# EAGLE design TrackerBase2 (EAGLE 9.6.2)
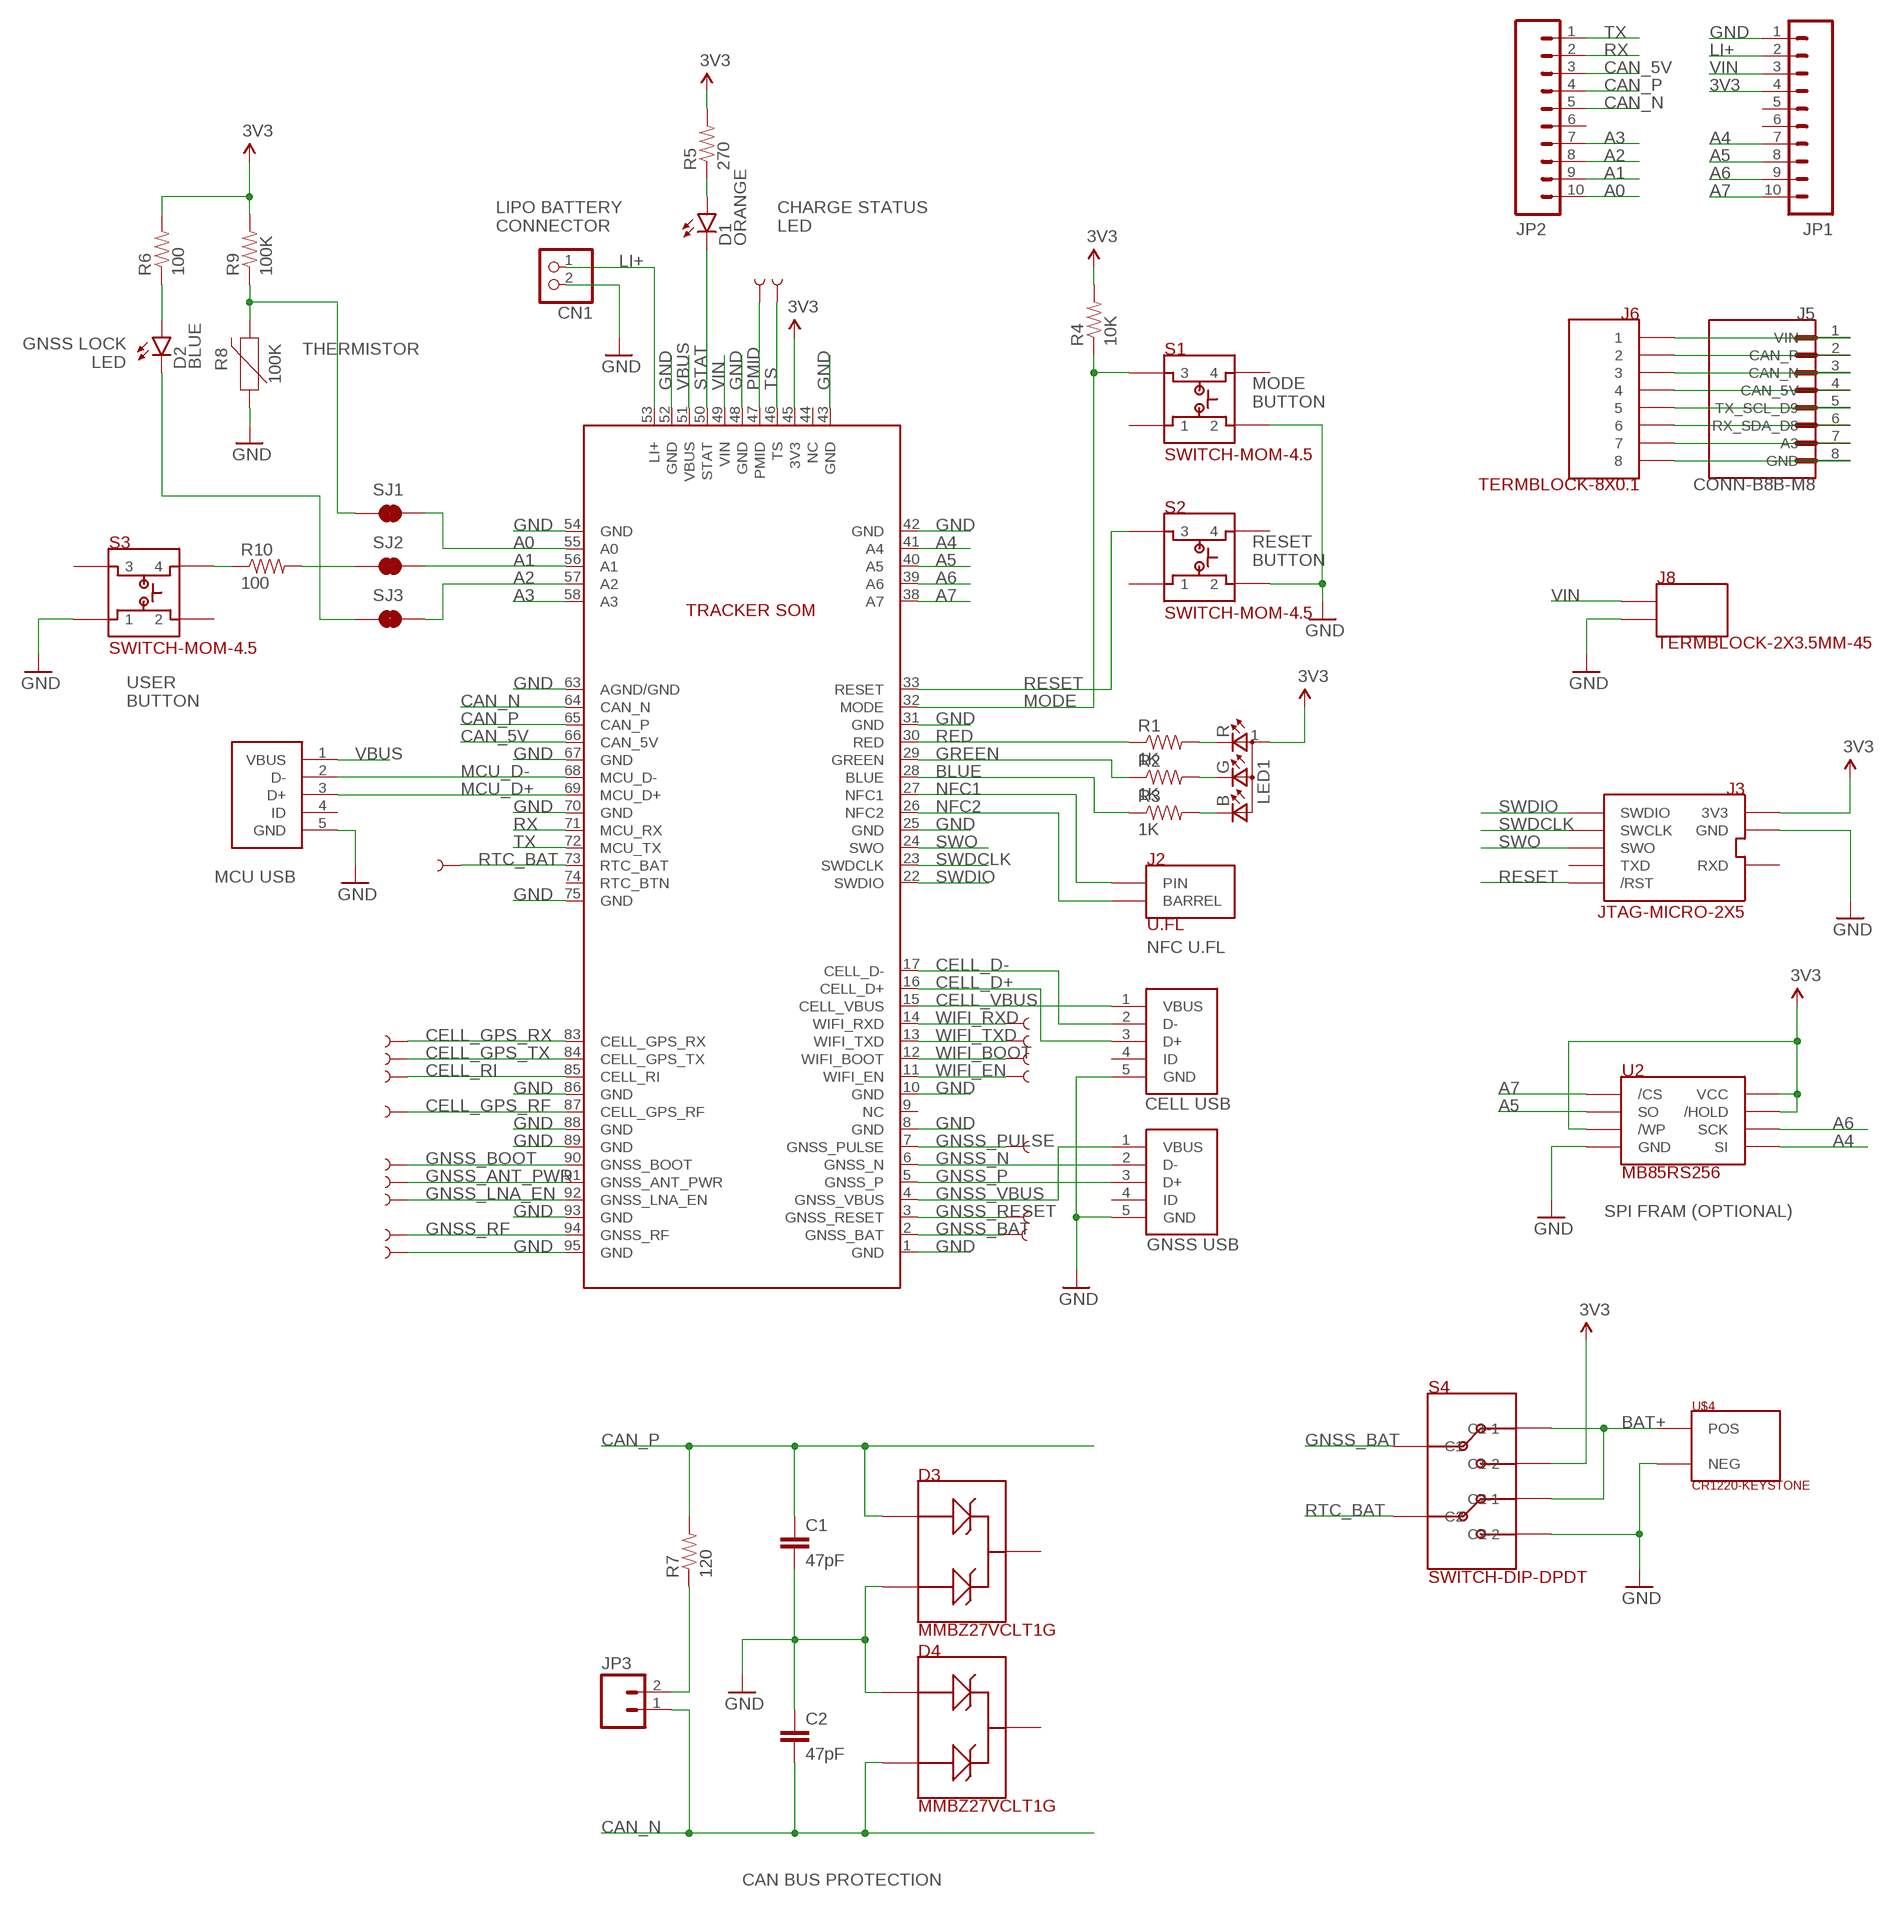
[diagram p0: schematic, sheet 1]

## Parts
C1  47pF  CAP-47PF-0603  [0603-CAP]
C2  47pF  CAP-47PF-0603  [0603-CAP]
CN1  JST_2PIN-THM  [JST-PH-2-THM]
D1  ORANGE  LED-ORANGE0603  [LED-0603]
D2  BLUE  LED-BLUE0603  [LED-0603]
D3  MMBZ27VCLT1G  TVS-MMBZ27VCLT1G  [SOT-23-3-ON]
D4  MMBZ27VCLT1G  TVS-MMBZ27VCLT1G  [SOT-23-3-ON]
J1  USB-MICRO-B-VERT-PTH  [USB-MICRO-B-VERT-PTH]
J2  U.FL  CONN-UFL-TE  [CONN-UFL-TE]
J3  JTAG-MICRO-2X5  [JTAG-MICRO-2X5]
J4  USB-MICRO-B-VERT-PTH  [USB-MICRO-B-VERT-PTH]
J5  CONN-B8B-M8  [JST_B8B-PH-SM4-TB(LF)(SN)]
J6  TERMBLOCK-8X0.1  [TERMBLOCK-8X0.1]
J7  USB-MICRO-B-VERT-PTH  [USB-MICRO-B-VERT-PTH]
J8  TERMBLOCK-2X3.5MM-45  [TERMBLOCK-2X3.5MM-45]
JP1  M10  [1X10]
JP2  M10  [1X10]
JP3  M02PTH  [1X02]
LED1  RGB  LED-RGB-CREE-SMD  [LED-RGB-CREE-SMD]
R1  1K  RES-1K-0603  [0603-RES]
R2  1K  RES-1K-0603  [0603-RES]
R3  1K  RES-1K-0603  [0603-RES]
R4  10K  RES-10K-06030603  [0603-RES]
R5  270  RES-270-0603.DEV  [0603-RES]
R6  100  RES-100-0603.DEV  [0603-RES]
R7  120  RES-120-0603  [0603-RES]
R8  100K  NTC-THERMISTOR-0603  [0603]
R9  100K  RES-100K-0603  [0603-RES]
R10  100  RES-100-0603.DEV  [0603-RES]
S1  SWITCH-MOM-4.5  [SWITCH-MOM-4.5]
S2  SWITCH-MOM-4.5  [SWITCH-MOM-4.5]
S3  SWITCH-MOM-4.5  [SWITCH-MOM-4.5]
S4  SWITCH-DIP-DPDT  [SWITCH-DIP-DPDT]
SJ1  JUMPER-PAD-2-NC_BY_TRACENO_SILK  [PAD-JUMPER-2-NC_BY_TRACE_NO_SILK]
SJ2  JUMPER-PAD-2-NC_BY_TRACENO_SILK  [PAD-JUMPER-2-NC_BY_TRACE_NO_SILK]
SJ3  JUMPER-PAD-2-NC_BY_TRACENO_SILK  [PAD-JUMPER-2-NC_BY_TRACE_NO_SILK]
TP1  TEST-POINTTP_15TH_THRU  [TP_15TH]
TP2  TEST-POINTTP_15TH_THRU  [TP_15TH]
TP3  TEST-POINTTP_15TH_THRU  [TP_15TH]
TP4  TEST-POINTTP_15TH_THRU  [TP_15TH]
TP5  TEST-POINTTP_15TH_THRU  [TP_15TH]
TP6  TEST-POINTTP_15TH_THRU  [TP_15TH]
TP7  TEST-POINTTP_15TH_THRU  [TP_15TH]
TP8  TEST-POINTTP_15TH_THRU  [TP_15TH]
TP9  TEST-POINTTP_15TH_THRU  [TP_15TH]
TP10  TEST-POINTTP_15TH_THRU  [TP_15TH]
TP11  TEST-POINTTP_15TH_THRU  [TP_15TH]
TP12  TEST-POINTTP_15TH_THRU  [TP_15TH]
TP13  TEST-POINTTP_15TH_THRU  [TP_15TH]
TP14  TEST-POINTTP_15TH_THRU  [TP_15TH]
TP15  TEST-POINTTP_15TH_THRU  [TP_15TH]
TP16  TEST-POINTTP_15TH_THRU  [TP_15TH]
TP17  TEST-POINTTP_15TH_THRU  [TP_15TH]
TP18  TEST-POINTTP_15TH_THRU  [TP_15TH]
TP19  TEST-POINTTP_15TH_THRU  [TP_15TH]
U1  TRACKER-SOM-SKIP-NC  [TRACKER-SOM-SKIP-NC]
U2  MB85RS256  MB85RS256-FRAM  [8-SOIC-MAXIM]
U$4  CR1220-KEYSTONE  [CR1220-KEYSTONE]

## Nets
3V3: J3.1(3V3) JP1.4 LED1.1(A) R4.2 R5.2 R6.2 R9.2 S4.C1-2 U1.45(3V3) U2.3(/WP) U2.7(/HOLD) U2.8(VCC)
A0: JP2.10 SJ1.2 U1.55(A0)
A1: JP2.9 SJ2.2 U1.56(A1)
A2: JP2.8 SJ3.2 U1.57(A2)
A3: J5.7(A3) J6.P$7 JP2.7 U1.58(A3)
A4: JP1.7 U1.41(A4) U2.5(SI)
A5: JP1.8 U1.40(A5) U2.2(SO)
A6: JP1.9 U1.39(A6) U2.6(SCK)
A7: JP1.10 U1.38(A7) U2.1(/CS)
BAT+: S4.C1-1 S4.C2-1 U$4.POS
BLUE: R3.1 U1.28(BLUE)
CAN_5V: J5.4(CAN_5V) J6.P$4 JP2.3 U1.66(CAN_5V)
CAN_N: C2.2 D4.2 J5.3(CAN_N) J6.P$3 JP2.5 JP3.1 U1.64(CAN_N)
CAN_P: C1.1 D3.1 J5.2(CAN_P) J6.P$2 JP2.4 R7.2 U1.65(CAN_P)
CELL_D+: J1.3(D+) U1.16(CELL_D+)
CELL_D-: J1.2(D-) U1.17(CELL_D-)
CELL_GPS_RF: TP14.P$1 U1.87(CELL_GPS_RF)
CELL_GPS_RX: TP7.P$1 U1.83(CELL_GPS_RX)
CELL_GPS_TX: TP8.P$1 U1.84(CELL_GPS_TX)
CELL_RI: TP9.P$1 U1.85(CELL_RI)
CELL_VBUS: J1.1(VBUS) U1.15(CELL_VBUS)
GND: C1.2 C2.1 CN1.2 D3.2 D4.1 J1.5(GND) J3.3(GND) J3.5(GND) J3.9(GND) J4.5(GND) J5.8(GND) J6.P$8 J7.5(GND) J8.2 JP1.1 R8.1 S1.2 S2.2 S3.1 S4.C2-2 TP19.P$1 U1.1(GND) U1.8(GND) U1.10(GND) U1.25(GND) U1.31(GND) U1.42(GND) U1.43(GND) U1.48(GND) U1.52(GND) U1.54(GND) U1.63(AGND/GND) U1.67(GND) U1.70(GND) U1.75(GND) U1.86(GND) U1.88(GND) U1.89(GND) U1.93(GND) U1.95(GND) U2.4(GND) U$4.NEG
GNSS_ANT_PWR: TP11.P$1 U1.91(GNSS_ANT_PWR)
GNSS_BAT: S4.C1 TP17.P$1 U1.2(GNSS_BAT)
GNSS_BOOT: TP10.P$1 U1.90(GNSS_BOOT)
GNSS_LNA_EN: TP12.P$1 U1.92(GNSS_LNA_EN)
GNSS_N: J4.2(D-) U1.6(GNSS_N)
GNSS_P: J4.3(D+) U1.5(GNSS_P)
GNSS_PULSE: TP5.P$1 U1.7(GNSS_PULSE)
GNSS_RESET: TP6.P$1 U1.3(GNSS_RESET)
GNSS_RF: TP13.P$1 U1.94(GNSS_RF)
GNSS_VBUS: J4.1(VBUS) U1.4(GNSS_VBUS)
GREEN: R2.1 U1.29(GREEN)
LI+: CN1.1 JP1.2 U1.53(LI+)
MCU_D+: J7.3(D+) U1.69(MCU_D+)
MCU_D-: J7.2(D-) U1.68(MCU_D-)
MODE: R4.1 S1.3 U1.32(MODE)
N$2: JP3.2 R7.1
N$3: LED1.2(B) R3.2
N$4: LED1.3(G) R2.2
N$5: LED1.4(R) R1.2
N$14: D1.A R5.1
N$16: R8.2 R9.1 SJ1.1
N$17: D2.A R6.1
N$18: R10.1 S3.4
N$19: R10.2 SJ2.1
N$20: D2.C SJ3.1
NFC1: J2.PIN U1.27(NFC1)
NFC2: J2.BL(BARREL) J2.BR(BARREL) U1.26(NFC2)
PMID: TP15.P$1 U1.47(PMID)
RED: R1.1 U1.30(RED)
RESET: J3.10(/RST) S2.3 U1.33(RESET)
RTC_BAT: S4.C2 TP18.P$1 U1.73(RTC_BAT)
RX: J5.6(RX_SDA_D8) J6.P$6 JP2.2 U1.71(MCU_RX)
STAT: D1.C U1.50(STAT)
SWDCLK: J3.4(SWCLK) U1.23(SWDCLK)
SWDIO: J3.2(SWDIO) U1.22(SWDIO)
SWO: J3.6(SWO) U1.24(SWO)
TS: TP16.P$1 U1.46(TS)
TX: J5.5(TX_SCL_D9) J6.P$5 JP2.1 U1.72(MCU_TX)
VBUS: J7.1(VBUS) U1.51(VBUS)
VIN: J5.1(VIN) J6.P$1 J8.1 JP1.3 U1.49(VIN)
WIFI_BOOT: TP3.P$1 U1.12(WIFI_BOOT)
WIFI_EN: TP4.P$1 U1.11(WIFI_EN)
WIFI_RXD: TP1.P$1 U1.14(WIFI_RXD)
WIFI_TXD: TP2.P$1 U1.13(WIFI_TXD)
Unconnected: D3.3 D4.3 J1.4(ID) J3.7(RXD) J3.8(TXD) J4.4(ID) J7.4(ID) JP1.5 JP1.6 JP2.6 S1.1 S1.4 S2.1 S2.4 S3.2 S3.3 U1.9(NC) U1.44(NC) U1.74(RTC_BTN)

## Notes on the sheet
- LIPO BATTERY
  CONNECTOR
- CHARGE STATUS
  LED
- GNSS LOCK
  LED
- THERMISTOR
- MODE
  BUTTON
- RESET
  BUTTON
- USER
  BUTTON
- MCU USB
- NFC U.FL
- CELL USB
- SPI FRAM (OPTIONAL)
- GNSS USB
- CAN BUS PROTECTION

## Library data of the parts
C1 C2 = rickk2:CAP-47PF-0603: CAP CER 47PF 100V C0G/NP0 0603 Murata Electronics GCM1885C2A470FA16D $0.22 47pF ±1% 100V Ceramic Capacitor C0G, NP0 0603 (1608 Metric) https://www.digikey.com/product-detail/en/murata-electronics/GCM1885C2A470FA16D/490-16408-1-ND/7363390 - Ordered 10 2020-08-27
CN1 = rickk2:JST_2PIN: JST 2-Pin Connectors of various flavors SMT-RA (S2B-PH-SM4) 4UConnector #17311 SMT (B2B-PH-SM4) THM-RA (S2B-PH) THM (B2B-PH) 1=+ 2=- THM: CONN HEADER PH TOP 2POS 2MM $0.17 B2B-PH-K-S(LF)(SN) https://www.digikey.com/product-detail/en/jst-sales-america-inc/B2B-PH-K-S-LF-SN/455-1704-ND/926611 RA Version: https://www.digikey.com/products/en?keywords=455-1719-ND
D1 = rickk2:LED-ORANGE: Lite-On LTST-C193KFKT-5A LED ORANGE CLEAR 0603 SMD $ 0.41 Orange 605nm LED Indication - Discrete 2V 0603 (1608 Metric) https://www.digikey.com/product-detail/en/lite-on-inc/LTST-C193KFKT-5A/160-1829-1-ND/2356249 R = 270 ohms @ 3.3V Stripe is on the anode (+) side on the bottom side!
D2 = rickk2:LED-BLUE: Lite-On LTST-C193TBKT-5A 0603 clear lens 6.25 mcd 130° viewing 15 mcd 5mA @ 2.8V $0.47 Blue 470nm LED Indication - Discrete 2.8V 0603 (1608 Metric) https://www.digikey.com/product-detail/en/lite-on-inc/LTST-C193TBKT-5A/160-1827-1-ND/2355044 R = 100 ohms @ 3.3V Stripe is on the anode (+) side on the bottom side!
D3 D4 = rickk2:TVS-MMBZ27VCLT1G: TVS DIODE 22V 38V SOT23-3 ON Semiconductor MMBZ27VCLT1G $0.20 38V Clamp 1A Ipp Tvs Diode Surface Mount SOT-23-3 (TO-236) https://www.digikey.com/product-detail/en/on-semiconductor/MMBZ27VCLT1G/MMBZ27VCLT1GOSCT-ND/964555
J1 J4 J7 = rickk2:USB-MICRO-B-VERT-PTH: MICRO B SKT, VERTICAL, TH GCT USB3131-30-0230-A $0.84 USB - micro B USB 2.0 Receptacle Connector 5 Position Through Hole https://www.digikey.com/product-detail/en/gct/USB3131-30-0230-A/2073-USB3131-30-0230-ACT-ND/9859713
J2 = rickk2:CONN-UFL-TE: U.FL TE Connectivity AMP Connectors 1909763-1 $0.50 CONN UMCC JACK STR 50OHM SMD U.FL (UMCC) Connector Jack, Male Pin 50Ohm Surface Mount Solder https://www.digikey.com/product-detail/en/te-connectivity-amp-connectors/1909763-1/A118077CT-ND/4729711
J3 = rickk2:JTAG-MICRO-2X5: JTAG Connector $2.90 CONN HEADER SMD 10POS 1.27MM Connector Header Surface Mount 10 position 0.050" (1.27mm) Samtec FTSH-105-01-F-DV-K https://www.digikey.com/product-detail/en/FTSH-105-01-F-DV-K/SAM8796-ND/2649974?utm_campaign=buynow&WT.z_cid=ref_octopart_dkc_buynow&utm_medium=aggregator&curr=usd&site=us&utm_source=octopart
J5 = rickk2:CONN-B8B-M8: PH Series 2 mm Pitch 12 Position SMT Single Row Top Entry Shrouded Header
J6 = rickk2:TERMBLOCK-8X0.1: Term Block 8x0.1" 20-30AWG 6A 125V Max Side Entry On Shore Technology Inc. OSTVN08A150 TERM BLK 8P SIDE ENT 2.54MM PCB 8 Position Wire to Board Terminal Block Horizontal with Board 0.100" (2.54mm) Through Hole https://www.digikey.com/product-detail/en/on-shore-technology-inc/OSTVN08A150/ED10566-ND/1588868
J8 = rickk2:TERMBLOCK-2X3.5MM-45: TERM BLOCK 2POS 45DEG 3.5MM PCB Phoenix Contact 1988956 $0.48 2 Position Wire to Board Terminal Block 45° (135°) Angle with Board 0.138" (3.50mm) Through Hole https://www.digikey.com/product-detail/en/phoenix-contact/1988956/277-1779-ND/950907
JP1 JP2 = rickk2:M10: Sullins Connector Solutions PPTC101LFBN-RC $0.65 10 Position Header Connector Through Hole https://www.digikey.com/product-detail/en/sullins-connector-solutions/PPTC101LFBN-RC/S7008-ND/810149
JP3 = rickk2:M02: Standard 2-pin 0.1" header. Use with - straight break away headers ( PRT-00116) - right angle break away headers (PRT-00553) - swiss pins (PRT-00743) - machine pins (PRT-00117) - female headers (PRT-00115) Molex polarized connector foot print use with: PRT-08233 with associated crimp pins and housings. 2.54_SCREWTERM for use with PRT-10571. 3.5mm Screw Terminal footprints for PRT-08084 5mm Screw Terminal footprints for use with PRT-08432
LED1 = rickk2:LED-RGB-CREE-SMD: https://www.digikey.com/product-detail/en/cree-inc/CLMVC-FKA-CL1D1L71BB7C3C3/CLMVC-FKA-CL1D1L71BB7C3C3CT-ND/9094273 CLMVC-FKA-CL1D1L71BB7C3C3 LED RGB CLEAR 4PLCC SMD Red, Green, Blue (RGB) 622nm Red, 530nm Green, 470nm Blue LED Indication - Discrete 2V Red, 3V Green, 3V Blue 4-SMD, J-Lead $0.19 Millicandela Rating 337mcd Red, 420mcd Green, 84mcd Blue Voltage - Forward (Vf) (Typ) 2V Red, 3V Green, 3V Blue Current - Test 20mA Red, 10mA Green, 10mA Blue Wavelength - Dominant 622nm Red, 530nm Green, 470nm Blue 2.00mm L x 2.00mm W x 1.00mm H Old One: LED RGB DIFFUSED 4SMD $ 0.35 Cree CLMVB-FKA-CFHEHLCBB7A363 2mm 4-PLCC common anode RGB LED https://www.digikey.com/product-detail/en/cree-inc/CLMVB-FKA-CFHEHLCBB7A363/CLMVB-FKA-CFHEHLCBB7A363CT-ND/6138627 Red=68 ohm, Green/Blue=33 ohm @ 3.3V
R1-R3 = rickk2:RES-1K-0603: RES SMD 1K OHM 0.5% 1/5W 0603 $ 0.17 https://www.digikey.com/product-detail/en/panasonic-electronic-components/ERJ-PB3D1001V/P20283CT-ND/6214538 Panasonic
R4 = rickk2:RES-10K-0603: RES SMD 10K OHM 5% 1/4W 0603 $ 0.10 https://www.digikey.com/product-detail/en/panasonic-electronic-components/ERJ-PA3J103V/P10KBZCT-ND/5036237
R5 = rickk2:RES-270-0603.DEV: RES SMD 270 OHM 5% 1/10W 0603 $0.10 Panasonic ERJ-3GEYJ271V ±5% 0.1W, 1/10W Chip Resistor 0603 (1608 Metric) Automotive AEC-Q200 Thick Film https://www.digikey.com/product-detail/en/panasonic-electronic-components/ERJ-3GEYJ271V/P270GCT-ND/134766
R6 R10 = rickk2:RES-100-0603.DEV: RES SMD 100 OHM 5% 1/10W 0603 $ 0.10 ±5% 0.1W, 1/10W Chip Resistor 0603 (1608 Metric) Automotive AEC-Q200 Thick Film https://www.digikey.com/product-detail/en/panasonic-electronic-components/ERJ-3GEYJ101V/P100GCT-ND/134714
R7 = rickk2:RES-120-0603: Not ordered yet! Panasonic Electronic Components ERJ-3EKF1200V RES SMD 120 OHM 1% 1/10W 0603 120 Ohms ±1% 0.1W, 1/10W Chip Resistor 0603 (1608 Metric) Automotive AEC-Q200 Thick Film https://www.digikey.com/product-detail/en/panasonic-electronic-components/ERJ-3EKF1200V/P120HCT-ND/1746726
R8 = rickk2:NTC-THERMISTOR: NTC Thermistor An NTC thermistor's resistance decreases as temperature rises. Applications: Resistance Thermometer - temperature monitoring Inrush current limiter Heat source; PROD_ID: RES-13608; VALUE: 10k
R9 = rickk2:RES-100K-0603: 100 kOhms ±1% 0.1W, 1/10W Chip Resistor 0603 (1608 Metric) Automotive AEC-Q200 Thick Film https://www.digikey.com/product-detail/en/panasonic-electronic-components/ERJ-3EKF1003V/P100KHCT-ND/198110 Old: RES SMD 100K OHM 1% 1/4W 0603 $ 0.16 Panasonic ERJ-PA3F1003V ±1% 0.25W, 1/4W Chip Resistor 0603 (1608 Metric) Automotive AEC-Q200, Pulse Withstanding Thick Film https://www.digikey.com/product-detail/en/panasonic-electronic-components/ERJ-PA3F1003V/P100KBYCT-ND/5036116
S1-S3 = rickk2:SWITCH-MOM-4.5: Manufacturer: E-Switch Manufacturer Part Number: TL3305AF160QG Description: SWITCH TACTILE SPST-NO 50MA 12V Detailed Description: Tactile Switch SPST-NO Top Actuated Surface Mount $0.20 https://www.digikey.com/product-detail/en/e-switch/TL3305AF160QG/EG5350CT-ND/5816195
S4 = rickk2:SWITCH-DIP-DPDT: SWITCH ROCKER DIP DPDT 150MA 30V Grayhill Inc. 76SD01T $3.84 Dip Switch DPDT 1 Position Through Hole Rocker Actuator 150mA 30VDC https://www.digikey.com/product-detail/en/grayhill-inc/76SD01T/GH7719-ND/2680736
SJ1-SJ3 = rickk2:JUMPER-PAD-2-NC_BY_TRACE
TP1-TP19 = rickk2:TEST-POINT: SparkFun Test Points Bare copper test points for troubleshooting or In-Circuit-Testing. These are used by our Production team for verifying production board runs using pogo-pins on test beds. SparkFun Products: SparkFun LSM9DS1 Breakout <https://www.sparkfun.com/products/13284> SparkFun PSOC <https://www.sparkfun.com/products/13714> SparkFun Load Cell Amplifier <https://www.sparkfun.com/products/13879>
U1 = rickk2:TRACKER-SOM-SKIP-NC: Tracker SoM
U2 = rickk2:MB85RS256-FRAM: IC FRAM 256K SPI 33MHZ 8SOP Fujitsu Electronics America, Inc. MB85RS256BPNF-G-JNERE1 $3.75 FRAM (Ferroelectric RAM) Memory IC 256Kb (32K x 8) SPI 33MHz 8-SOP https://www.digikey.com/product-detail/en/fujitsu-electronics-america-inc/MB85RS256BPNF-G-JNERE1/865-1251-1-ND/4022686; VALUE: MB85RC64
U$4 = rickk2:CR1220-KEYSTONE: Keystone Electronics 1056TR $ 1.09 BATTERY HOLDER COIN 12.5MM SMD https://www.digikey.com/product-detail/en/keystone-electronics/1056/36-1056-ND/2020198

## Board
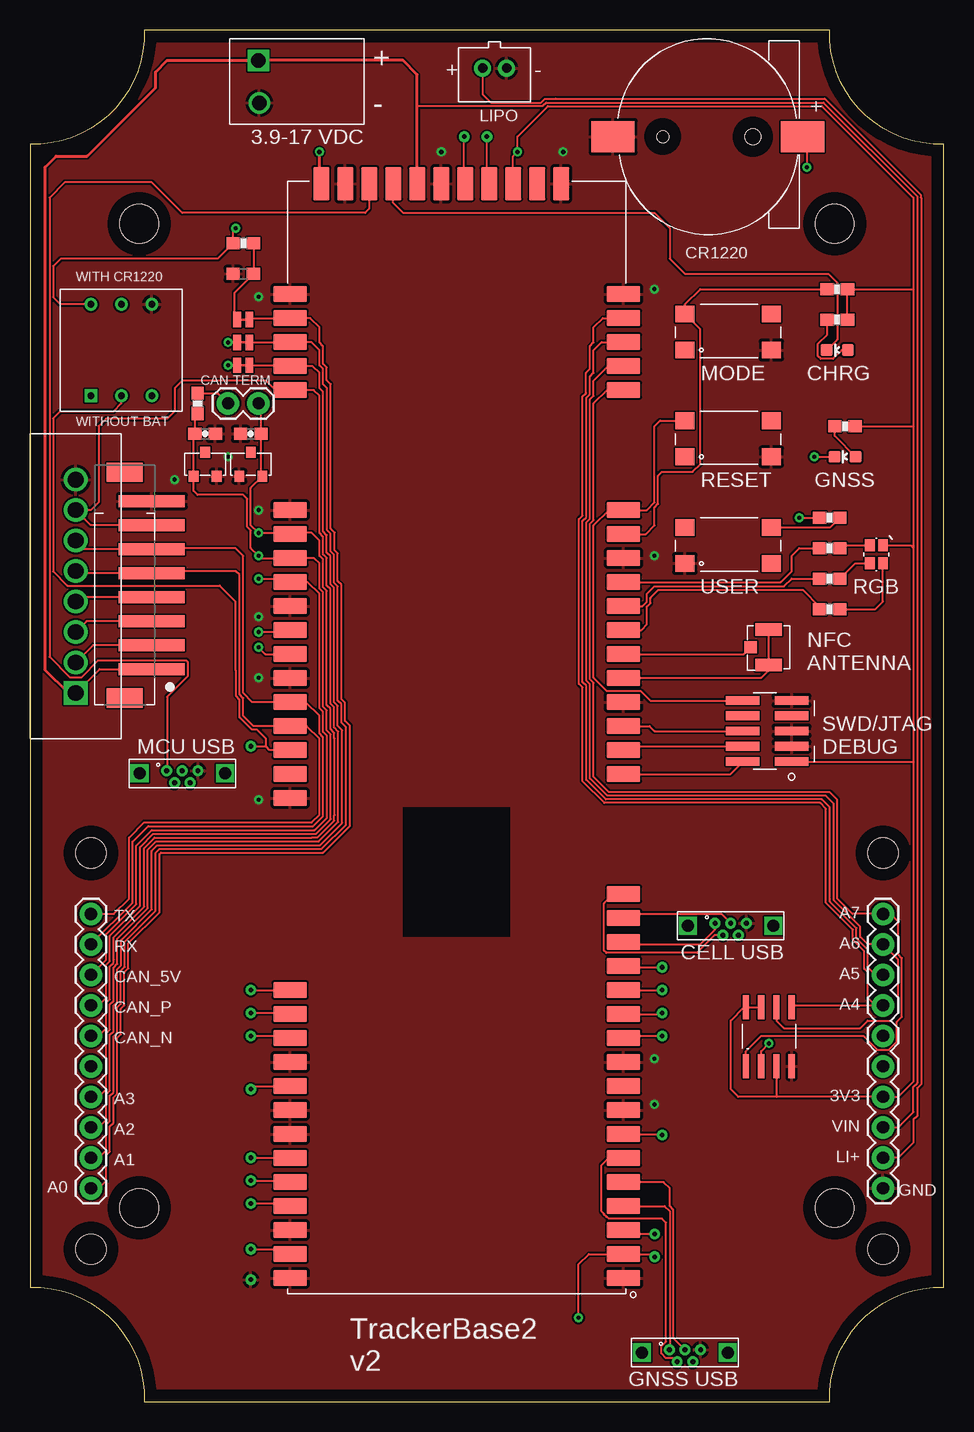
[diagram p1: board, top side]
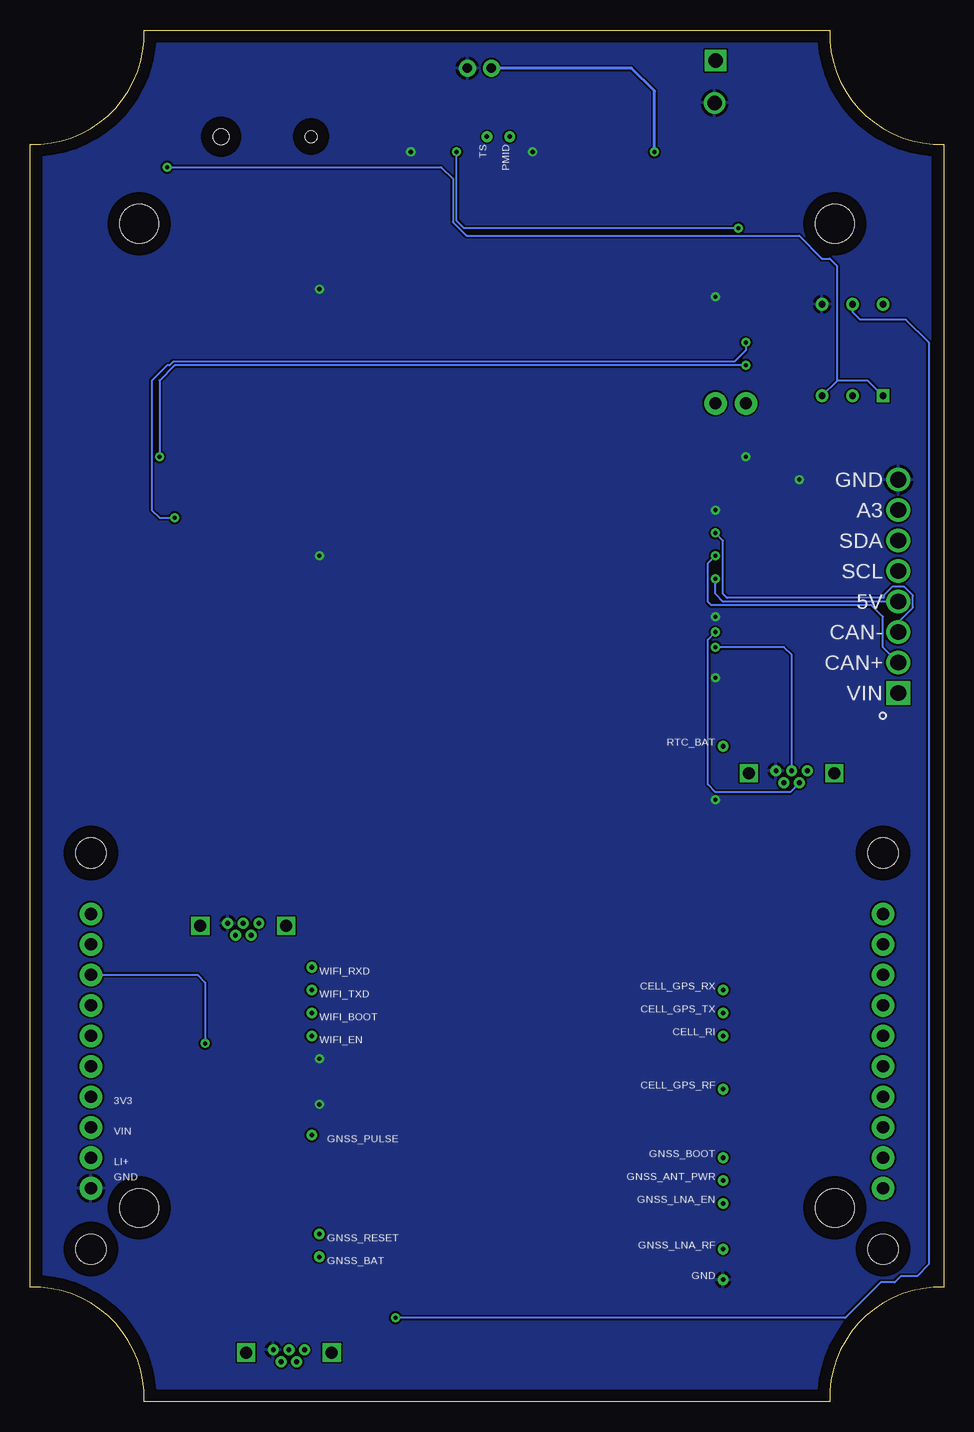
[diagram p2: board, bottom side, seen from below]

Size 76.2 x 114.3 mm. Coordinates in mm from the lower left corner, seen from the top.
Outline: 9.53,0 66.67,0 arc-94 76.2,9.53 76.2,104.78 arc-94 66.67,114.3 9.53,114.3 arc-94 0,104.78 0,9.53 arc-94 9.53,0
Copper layers (1*16): Top 0.035mm / dielectric 1.5mm / Bottom 0.035mm
Design rules "default": minimum track width 6mil, minimum drill 0.35mm, track to track 6mil, track to pad 6mil, pad to pad 6mil, via to via 6mil, smd to smd 6mil, copper to edge 40mil, drill to drill 6mil, minimum pad ring 10mil, minimum via ring 8mil, stop-mask expansion 4mil, vias tented up to drill 0mil, thermal gap 10mil
Holes 3.2 mm at 67.1,98.15 9.1,98.15 9.1,16.15 67.1,16.15
Holes 2.51 mm at 5.08,12.7 71.12,12.7 71.12,45.72 5.08,45.72
bKeepout: area 6.6,74.7 to 11.6,79.7; area 6.6,34.6 to 11.6,39.6; area 64.6,34.6 to 69.6,39.6; area 64.6,74.7 to 69.6,79.7; area 35.6,102.7 to 40.6,107.7; area 35.6,6.7 to 40.6,11.7

### Footprints (pad centres in the part's own frame; a part is rotated, then mirrored left to right if it is on the bottom)
0603-CAP = smd 1.1 x 1: 1 -0.85,0; 2 0.85,0
JST-PH-2-THM = drill 0.8 pad 1.422: 1 1,0; 2 -1,0
LED-0603 = smd 1 x 1: A 0,-0.877; C 0,0.877
SOT-23-3-ON = smd 0.8 x 0.9: 1 -0.96,-1; 2 0.96,-1; 3 0,1
USB-MICRO-B-VERT-PTH = drill 0.4: 1 -1.3,0.5; 2 -0.65,-0.5; 3 0,0.5; 4 0.65,-0.5; 5 1.3,0.5 | drill 1 square: P$1 -3.575,0.28; P$2 3.575,0.28
CONN-UFL-TE = smd 1.05 x 2.2: BL -1.475,0; BR 1.475,0 | smd 1 x 1.05: PIN 0,-1.525
JTAG-MICRO-2X5 = smd 0.737 x 2.794: 1 0,0; 2 0,4.064; 3 1.27,0; 4 1.27,4.064; 5 2.54,0; 6 2.54,4.064; 7 3.81,0; 8 3.81,4.064; 9 5.08,0; 10 5.08,4.064
JST_B8B-PH-SM4-TB(LF)(SN) = smd 1 x 5.5: 1 -5,0; 2 -3,0; 3 -1,0; 4 1,0; 5 3,0; 6 5,0; 7 7,0; 8 9,0 | smd 1.6 x 3: P1 -7.4,2.25; P2 11.4,2.25
TERMBLOCK-8X0.1 = drill 1.321 square: P$1 -8.89,0 | drill 1.321: P$2 -6.35,0; P$3 -3.81,0; P$4 -1.27,0; P$5 1.27,0; P$6 3.81,0; P$7 6.35,0; P$8 8.89,0
TERMBLOCK-2X3.5MM-45 = drill 1.2 square: 1 0,0 | drill 1.2: 2 3.54,0.07
1X10 = drill 1.016 pad 1.88: 1 0,0; 2 2.54,0; 3 5.08,0; 4 7.62,0; 5 10.16,0; 6 12.7,0; 7 15.24,0; 8 17.78,0; 9 20.32,0; 10 22.86,0
1X02 = drill 1.016 pad 1.88: 1 0,0; 2 2.54,0
LED-RGB-CREE-SMD = smd 1 x 0.8: 1 1.5,0; 2 0,0; 3 0,1.1; 4 1.5,1.1
0603-RES = smd 1.1 x 1: 1 -0.85,0; 2 0.85,0
0603 = smd 1.1 x 1: 1 -0.85,0; 2 0.85,0
SWITCH-MOM-4.5 = smd 1.6 x 1.4: 1 0,0; 2 7.2,0; 3 0,3; 4 7.2,3
SWITCH-DIP-DPDT = drill 0.559: C1 0,5.08; C1-2 -2.54,5.08; C2 0,-2.54; C2-1 2.54,-2.54; C2-2 2.54,5.08 | drill 0.559 square: C1-1 -2.54,-2.54
PAD-JUMPER-2-NC_BY_TRACE_NO_SILK = smd 0.635 x 1.27: 1 -0.508,0; 2 0.508,0
TP_15TH = drill 0.381 pad 0.61: P$1 0,0
TRACKER-SOM-SKIP-NC = smd 2.8 x 1.35: 1 27.9,-91.3; 2 27.9,-89.3; 3 27.9,-87.3; 4 27.9,-85.3; 5 27.9,-83.3; 6 27.9,-81.3; 7 27.9,-79.3; 8 27.9,-77.3; 9 27.9,-75.3; 10 27.9,-73.3; 11 27.9,-71.3; 12 27.9,-69.3; 13 27.9,-67.3; 14 27.9,-65.3; 15 27.9,-63.3; 16 27.9,-61.3; 17 27.9,-59.3; 22 27.9,-49.3; 23 27.9,-47.3; 24 27.9,-45.3; 25 27.9,-43.3; 26 27.9,-41.3; 27 27.9,-39.3; 28 27.9,-37.3; 29 27.9,-35.3; 30 27.9,-33.3; 31 27.9,-31.3; 32 27.9,-29.3; 33 27.9,-27.3; 38 27.9,-17.3; 39 27.9,-15.3; 40 27.9,-13.3; 41 27.9,-11.3; 42 27.9,-9.3; 54 0.1,-9.3; 55 0.1,-11.3; 56 0.1,-13.3; 57 0.1,-15.3; 58 0.1,-17.3; 63 0.1,-27.3; 64 0.1,-29.3; 65 0.1,-31.3; 66 0.1,-33.3; 67 0.1,-35.3; 68 0.1,-37.3; 69 0.1,-39.3; 70 0.1,-41.3; 71 0.1,-43.3; 72 0.1,-45.3; 73 0.1,-47.3; 74 0.1,-49.3; 75 0.1,-51.3; 83 0.1,-67.3; 84 0.1,-69.3; 85 0.1,-71.3; 86 0.1,-73.3; 87 0.1,-75.3; 88 0.1,-77.3; 89 0.1,-79.3; 90 0.1,-81.3; 91 0.1,-83.3; 92 0.1,-85.3; 93 0.1,-87.3; 94 0.1,-89.3; 95 0.1,-91.3 | smd 1.35 x 2.8: 43 22.7,-0.1; 44 20.7,-0.1; 45 18.7,-0.1; 46 16.7,-0.1; 47 14.7,-0.1; 48 12.7,-0.1; 49 10.7,-0.1; 50 8.7,-0.1; 51 6.7,-0.1; 52 4.7,-0.1; 53 2.7,-0.1
8-SOIC-MAXIM = smd 0.53 x 1.98: 1 0,0; 2 1.27,0; 3 2.54,0; 4 3.81,0; 5 3.81,4.93; 6 2.54,4.93; 7 1.27,4.93; 8 0,4.93
CR1220-KEYSTONE = smd 3.6 x 2.6: NEG -7.9,0; POS 7.9,0 | hole 1: -3.75,0 | hole 1.3: 3.75,0

### Placement (x,y rotation side)
C1  14.61,80.64 0 top
C2  18.41,80.64 0 top
CN1  38.73,111.12 180 top
D1  67.31,87.63 90 top
D2  67.94,78.74 90 top
D3  14.61,78.11 0 top
D4  18.41,78.11 0 top
J1  58.42,39.37 0 top
J2  61.59,62.87 270 top
J3  63.5,53.34 90 top
J4  54.61,3.81 0 top
J5  10.16,66.04 90 top
J6  3.81,67.94 90 top
J7  12.7,52.07 0 top
J8  19.05,111.76 270 top
JP1  71.12,17.78 90 top
JP2  5.08,40.64 270 top
JP3  19.05,83.19 180 top
LED1  71.12,69.85 90 top
R1  66.67,71.12 0 top
R2  66.67,68.58 0 top
R3  66.67,66.04 0 top
R4  67.31,92.71 0 top
R5  67.31,90.17 0 top
R6  67.94,81.28 0 top
R7  13.97,83.19 270 top
R8  17.78,93.98 0 top
R9  17.78,96.52 180 top
R10  66.67,73.66 180 top
S1  54.61,87.63 0 top
S2  54.61,78.74 0 top
S3  54.61,69.85 0 top
S4  7.62,86.36 0 top
SJ1  17.78,90.17 0 top
SJ2  17.78,88.27 0 top
SJ3  17.78,86.36 0 top
TP1  52.7,36.2 0 top
TP2  52.7,34.29 0 top
TP3  52.7,32.38 0 top
TP4  52.7,30.48 0 top
TP5  52.7,22.23 0 top
TP6  52.07,13.97 0 top
TP7  18.41,34.29 0 top
TP8  18.41,32.38 0 top
TP9  18.41,30.48 0 top
TP10  18.41,20.32 0 top
TP11  18.41,18.41 0 top
TP12  18.41,16.51 0 top
TP13  18.41,12.7 0 top
TP14  18.41,26.04 0 top
TP15  36.2,105.41 90 top
TP16  38.1,105.41 90 top
TP17  52.07,12.06 0 top
TP18  18.41,54.61 0 top
TP19  18.41,10.16 0 top
U1  21.59,101.6 0 top
U2  59.69,27.94 0 top
U$4  56.52,105.41 0 top

### Tracks (layer width: path | path; a pad name or v marks a point on that pad's centre or on a via)
3V3  (via drill 0.35)
  Top 0.152: U1.45 40.29,103.79 v40.64,104.14 40.64,105.41 43.18,107.95 66.04,107.95 73.66,100.33 73.66,92.71 | v17.14,97.79 16.93,97.58 R9.2 15.66,95.25 2.56,95.25 1.93,94.61 1.93,92.05 2.54,91.44 S4.C1-2 | R5.2 R4.2 73.66,92.71 | 73.66,92.71 73.66,81.28 | 73.66,81.28 73.66,71.12 | 73.66,71.12 73.66,53.34 | 73.66,53.34 73.66,26.67 72.39,25.4 JP1.4 62.23,25.4 | J3.1 73.66,53.34 | LED1.1 73.43,71.35 73.66,71.12 | R6.2 73.66,81.28 | 62.23,25.4 59.05,25.4 58.42,26.04 58.42,31.75 59.54,32.87 U2.8 U2.7 | U2.3 62.23,25.4
  Bottom 0.152: v17.14,97.79 40.01,97.79 40.64,98.42 v40.64,104.14
A0
  Top 0.152: SJ1.2 18.42,90.3 21.59,90.3 U1.55 23.36,90.3 24.13,89.53 24.13,88.27 24.43,87.96 24.43,86.49 24.74,86.18 24.74,85.11 25.07,84.78 25.07,72.74 25.4,72.41 25.4,70.94 25.65,70.69 25.65,68.37 25.96,68.07 25.96,58.54 26.26,58.24 26.26,56.72 26.67,56.31 26.67,47.99 24.43,45.74 10.92,45.74 10.79,45.62 10.79,40.8 8.2,38.21 8.2,36.1 7.87,35.77 7.87,33.02 7.57,32.72 7.57,30.61 7.26,30.3 7.26,25.66 6.96,25.35 6.96,23.24 6.66,22.94 6.66,20.83 6.35,20.52 6.35,18.41 5.71,17.78 JP2.10
A1
  Top 0.152: SJ2.2 21.66,88.27 | 21.66,88.27 U1.56 | JP2.9 5.71,20.32 6.35,20.95 6.35,23.06 6.66,23.37 6.66,25.48 6.96,25.78 6.96,30.43 7.26,30.74 7.26,32.84 7.57,33.15 7.57,35.89 7.9,36.22 7.9,38.33 10.46,40.9 10.46,45.72 10.79,46.05 24.3,46.05 26.34,48.09 26.34,56.21 25.96,56.59 25.96,58.11 25.65,58.42 25.65,67.94 25.35,68.25 25.35,70.56 25.04,70.86 25.04,72.34 24.77,72.62 24.77,84.45 24.43,84.78 24.43,86.06 24.13,86.36 24.13,87.63 23.5,88.27 21.66,88.27
A2
  Top 0.152: SJ3.2 21.63,86.36 U1.57 23.55,86.3 24.13,85.72 24.13,84.45 24.43,84.15 24.43,72.52 24.74,72.21 24.74,70.74 25.04,70.43 25.04,68.12 25.35,67.81 25.35,58.29 25.65,57.98 25.65,56.31 26.04,55.93 26.04,48.26 26.01,48.23 26.01,48.19 24.18,46.35 10.61,46.35 10.16,45.9 10.16,41.02 7.59,38.46 7.59,36.35 7.26,36.02 7.26,33.28 7,33.01 6.99,33 6.96,32.97 6.96,32.36 6.96,31.75 6.96,30.86 6.66,30.56 6.66,25.91 6.35,25.6 6.35,23.5 5.71,22.86 JP2.8
A3
  Top 0.152: J5.7 5.07,73.04 J6.P$7 5.08,74.3 5.71,74.93 5.71,81.28 6.35,81.92 11.43,81.92 12.06,82.55 12.06,84.45 12.7,85.09 19.68,85.09 20.48,84.3 U1.58 23.65,84.3 24.13,83.82 24.13,72.39 24.43,72.08 24.43,70.61 24.74,70.31 24.74,67.99 25.04,67.69 25.04,58.16 25.35,57.86 25.35,56.18 25.7,55.83 25.7,48.31 24.07,46.69 10.51,46.69 9.83,46 9.83,41.13 7.29,38.59 7.29,36.48 6.96,36.15 6.96,33.4 6.66,33.1 6.66,30.99 6.35,30.68 6.35,26.04 5.71,25.4 JP2.7
A4
  Top 0.152: U1.41 47.76,90.3 46.99,89.53 46.99,88.27 46.69,87.96 46.69,86.06 46.35,85.72 46.35,84.05 46.08,83.77 46.08,73.83 45.77,73.53 45.77,59.82 46.08,59.52 46.08,51.69 47.88,49.89 65.89,49.89 66.37,49.4 66.37,41.56 68.61,39.32 68.61,38.48 69.55,37.54 69.55,36.07 69.85,35.76 69.85,33.66 70.48,33.02 JP1.7 63.65,33.02 U2.5
A5  (via drill 0.35)
  Top 0.152: JP1.8 70.48,35.56 69.85,36.2 69.85,37.67 68.91,38.61 68.91,39.45 66.7,41.66 66.7,41.88 66.67,41.91 66.67,49.53 66.02,50.19 48.01,50.19 46.38,51.82 46.38,59.64 46.08,59.95 46.08,73.4 46.38,73.71 46.38,83.64 46.69,83.95 46.69,85.42 46.99,85.72 46.99,87.63 47.66,88.3 U1.40 | U2.2 60.96,29.21 v61.59,29.84
  Bottom 0.152: JP1.8 62.23,35.56 61.59,34.92 v61.59,29.84
A6
  Top 0.152: U1.39 48.2,86.3 46.99,85.09 46.99,83.82 46.69,83.52 46.69,73.58 46.38,73.28 46.38,60.07 46.69,59.77 46.69,51.94 48.13,50.49 66.34,50.49 67,49.84 67,41.78 69.22,39.57 69.22,38.73 69.85,38.1 JP1.9 72.39,36.83 72.39,32.38 71.75,31.75 69.85,31.75 69.22,31.11 62.87,31.11 62.23,31.75 U2.6
A7
  Top 0.152: U1.38 48.1,84.3 46.99,83.19 46.99,73.46 46.69,73.15 46.69,60.2 46.99,59.89 46.99,52.07 48.26,50.8 66.67,50.8 67.31,50.16 67.31,41.91 68.58,40.64 JP1.10 71.75,40.64 72.39,40.01 72.39,37.26 72.69,36.96 72.69,32.05 72.29,31.65 72.29,30 71.6,29.31 70.64,29.31 69.47,30.48 60.96,30.48 59.69,29.21 U2.1
BAT+  (via drill 0.35)
  Top 0.152: U$4.POS 64.77,105.06 v64.77,102.87
  Bottom 0.152: v64.77,102.87 41.91,102.87 40.95,101.91 40.95,98.3 39.8,97.16 12.06,97.16 10.16,95.25 9.53,95.25 8.89,94.61 8.89,85.09 | S4.C2-1 8.89,85.09 | S4.C1-1 6.35,85.09 8.89,85.09
BLUE
  Top 0.152: U1.28 50.97,64.3 51.44,64.77 51.44,66.24 51.74,66.55 51.74,66.98 52.4,67.64 64.44,67.64 65.83,66.25 R3.1
CAN_5V  (via drill 0.35)
  Top 0.152: J5.4 4.17,67.04 J6.P$4 | v19.05,68.58 21.41,68.58 U1.66 23.14,68.3 24.13,67.31 24.13,57.78 24.43,57.48 24.43,55.8 24.77,55.47 24.77,48.67 23.72,47.62 10.16,47.62 8.87,46.33 8.87,41.45 6.35,38.94 6.35,36.83 JP2.3
  Bottom 0.152: J6.P$4 18.41,66.67 19.05,67.31 v19.05,68.58
CAN_N  (via drill 0.35)
  Top 0.152: J5.3 4.71,65.04 J6.P$3 | 21.6,72.39 v19.05,72.39 18.41,73.03 18.41,76.14 D4.2 19.27,77.22 C2.2 19.27,82.97 JP3.1 | 21.6,72.39 U1.64 | JP2.5 5.71,30.48 6.35,31.11 6.35,33.22 6.66,33.53 6.66,36.27 6.96,36.58 6.96,36.8 6.99,36.83 6.99,38.71 9.53,41.25 9.53,46.13 10.39,46.99 23.5,46.99 23.52,47.02 23.98,47.02 25.38,48.41 25.38,48.87 25.4,48.9 25.4,55.24 25.38,55.27 25.38,55.73 25.04,56.05 25.04,57.73 24.74,58.04 24.74,67.56 24.43,67.87 24.43,70.18 24.13,70.48 24.13,71.75 23.5,72.39 21.6,72.39
  Bottom 0.152: v19.05,72.39 18.41,71.75 18.41,67.31 18.09,66.98 5.03,66.98 5.03,67.18 4.32,67.89 3.31,67.89 2.59,67.18 2.59,66.17 3.81,64.95 J6.P$3
CAN_P  (via drill 0.35)
  Top 0.152: J5.2 5.25,63.04 J6.P$2 | JP2.4 5.71,33.02 6.35,33.66 6.35,36.4 6.66,36.7 6.66,38.81 9.17,41.33 9.17,46.2 10.29,47.32 23.85,47.32 25.07,48.54 25.07,55.6 24.74,55.93 24.74,57.61 24.43,57.91 24.43,67.44 24.13,67.74 24.13,69.85 23.68,70.3 U1.65 19.23,70.3 v19.05,70.48 18.41,71.12 18.41,72.59 18.11,72.9 18.11,75.23 17.78,75.56 13.97,75.56 13.64,75.89 D3.1 13.64,80.53 C1.1 13.76,82.12 R7.2
  Bottom 0.152: J6.P$2 5.08,62.87 5.08,65.41 6.04,66.37 19.38,66.37 19.68,66.67 19.68,69.85 v19.05,70.48
CELL_D+
  Top 0.152: U1.16 49.83,40.64 57.65,40.64 J1.3
CELL_D-
  Top 0.152: J1.2 57.08,38.87 55.61,37.4 48.05,37.4 47.86,37.59 47.86,41.51 48.65,42.3 U1.17
CELL_GPS_RF
  Top 0.152: TP14.P$1 18.68,26.3 U1.87
CELL_GPS_RX
  Top 0.152: TP7.P$1 18.43,34.3 U1.83
CELL_GPS_TX
  Top 0.152: TP8.P$1 21.61,32.38 U1.84
CELL_RI
  Top 0.152: TP9.P$1 21.51,30.48 U1.85
CELL_VBUS
  Top 0.152: U1.15 49.69,38.1 55.88,38.1 57.12,39.34 J1.1
GND  (via drill 0.35)
  other vias: 52.07,28.57 52.07,24.77 52.07,70.48 44.45,104.14 52.07,92.71 34.29,104.14 19.05,65.41 19.05,60.33 19.05,50.16 19.05,74.3 12.06,76.83 19.05,92.08 16.51,78.74
  pour Top: 0,0 0,114.3 76.2,114.3 76.2,0
  pour Bottom: 0,0 0,114.3 76.2,114.3 76.2,0
GNSS_ANT_PWR
  Top 0.152: TP11.P$1 21.57,18.41 U1.91
GNSS_BAT  (via drill 0.35)
  Top 0.152: v45.72,6.99 45.72,11.43 46.59,12.3 U1.2 51.84,12.3 TP17.P$1
  Bottom 0.152: v45.72,6.99 8.22,6.99 5.27,9.94 4.11,9.94 3.59,10.46 2.24,10.46 1.27,11.43 1.27,88.27 3.17,90.17 6.99,90.17 7.62,90.81 S4.C1
GNSS_BOOT
  Top 0.152: TP10.P$1 21.67,20.32 U1.90
GNSS_LNA_EN
  Top 0.152: TP12.P$1 21.48,16.51 U1.92
GNSS_N
  Top 0.152: J4.2 53.62,3.65 53.59,3.63 53.03,3.63 52.63,4.03 52.63,4.59 53.03,4.99 53.03,14.91 52.7,15.24 48.26,15.24 48.1,15.4 48.05,15.4 47.86,15.59 47.86,15.64 47.62,15.88 47.62,19.68 48.24,20.3 U1.6
GNSS_P
  Top 0.152: J4.3 53.65,5.28 53.65,16 53.34,16.31 53.34,17.78 52.82,18.3 U1.5
GNSS_PULSE
  Top 0.152: U1.7 52.63,22.3 TP5.P$1
GNSS_RESET
  Top 0.152: U1.3 49.82,13.97 TP6.P$1
GNSS_RF
  Top 0.152: TP13.P$1 21.29,12.7 U1.94
GNSS_VBUS
  Top 0.152: U1.4 52.91,16.3 53.34,15.88 53.34,4.34 J4.1
GREEN
  Top 0.152: U1.29 51.06,66.3 51.44,66.67 51.44,67.31 52.07,67.94 62.87,67.94 63.5,68.58 R2.1
LI+  (via drill 0.35)
  Top 0.152: CN1.1 37.73,108.95 38.43,108.25 42.62,108.25 42.93,108.56 43.79,108.56 43.81,108.58 66.27,108.58 74.27,100.58 74.27,100.36 74.3,100.33 74.3,26.44 73.97,26.11 73.97,23.8 73.66,23.5 73.66,21.59 72.39,20.32 JP1.2
  Top 0.254: U1.53 24.13,101.66 v24.13,104.14
  Bottom 0.254: v24.13,104.14 24.13,109.22 26.04,111.12 CN1.1
MCU_D+  (via drill 0.35)
  Top 0.152: v19.05,62.87 19.61,62.3 U1.69
  Bottom 0.152: J7.3 12.7,62.23 13.34,62.87 v19.05,62.87
MCU_D-  (via drill 0.35)
  Top 0.152: v19.05,64.14 21.52,64.14 U1.68
  Bottom 0.152: J7.2 12.82,50.8 19.05,50.8 19.68,51.44 19.68,63.5 v19.05,64.14
MODE
  Top 0.152: U1.32 51.34,72.3 52.07,73.03 52.07,74.5 52.38,74.8 52.38,77.14 52.7,77.47 55.24,77.47 55.88,78.11 55.88,89.36 S1.3 54.61,91.44 55.88,92.71 R4.1
N$2
  Top 0.152: R7.1 15.66,84.03 JP3.2
N$3
  Top 0.152: R3.2 70.48,66.04 71.12,66.67 LED1.2
N$4
  Top 0.152: R2.2 68.8,69.85 LED1.3
N$5
  Top 0.152: R1.2 67.75,71.35 LED1.4
N$14
  Top 0.152: D1.A 67.67,87.63 66.94,86.9 65.93,86.9 65.7,87.12 65.7,88.14 66.46,88.89 R5.1
N$16
  Top 0.152: R9.1 R8.2 17.07,92.42 17.07,90.37 SJ1.1
N$17
  Top 0.152: D2.A 67.09,80.47 R6.1
N$18
  Top 0.152: R10.1 66.72,72.85 S3.4
N$19  (via drill 0.35)
  Top 0.152: SJ2.1 v16.51,88.27 | v64.14,73.66 R10.2
  Bottom 0.152: v16.51,88.27 16.51,87.63 17.48,86.67 64.26,86.67 64.57,86.36 64.77,86.36 66.04,85.09 66.04,74.3 65.41,73.66 v64.14,73.66
N$20  (via drill 0.35)
  Top 0.152: SJ3.1 v16.51,86.36 | v65.41,78.74 D2.C
  Bottom 0.152: v16.51,86.36 64.14,86.36 65.41,85.09 v65.41,78.74
NFC1
  Top 0.152: U1.27 59.51,62.3 J2.PIN
NFC2
  Top 0.152: U1.26 49.52,60.33 60.96,60.33 61.59,60.96 J2.BR J2.BL
PMID
  Top 0.152: U1.47 36.2,101.59 TP15.P$1
RED
  Top 0.152: U1.30 62.59,68.3 63.5,69.22 63.5,70.48 64.14,71.12 R1.1
RESET
  Top 0.152: J3.10 51.71,58.42 50.92,59.2 48.11,59.2 46.99,60.33 46.99,73.03 48.27,74.3 U1.33 51.43,74.3 51.44,74.3 52.07,74.93 52.07,81.28 52.53,81.74 S2.3
RTC_BAT
  Top 0.152: U1.73 20,54.3 19.68,54.61 | 19.68,54.61 19.68,55.24 18.93,55.99 18.5,55.99 17.48,57.02 17.48,58.5 17.17,58.8 17.17,60.94 17.14,60.96 17.14,66.67 15.82,68 3.12,68 1.93,69.19 1.93,81.94 2.54,82.55 6.99,82.55 7.62,83.19 S4.C2 | TP18.P$1 19.68,54.61
RX
  Top 0.152: J6.P$6 4.53,71.04 J5.6 10.24,71.12 17.14,71.12 17.78,70.48 17.78,59.05 18.54,58.3 U1.71 22.98,58.3 24.13,57.15 24.13,55.68 24.43,55.37 24.43,48.77 23.62,47.95 9.86,47.95 8.56,46.66 8.56,41.58 JP2.2
STAT
  Top 0.152: U1.50 30.29,99.89 31.11,99.06 52.07,99.06 53.34,97.79 53.34,95.25 54.61,93.98 66.56,93.98 67.31,93.23 67.31,88.51 D1.C
SWDCLK
  Top 0.152: U1.23 49.8,54.61 J3.4
SWDIO
  Top 0.152: J3.2 58.4,52.3 U1.22
SWO
  Top 0.152: U1.24 51.65,56.3 52.07,55.88 J3.6
TS
  Top 0.152: U1.46 38.1,101.69 TP16.P$1
TX
  Top 0.152: J6.P$5 3.98,69.04 J5.5 10.34,69.22 17.14,69.22 17.48,68.89 17.48,58.93 17.78,58.62 17.78,57.15 18.63,56.3 21.59,56.3 U1.72 23.07,56.3 24.13,55.24 24.13,48.9 23.5,48.26 9.53,48.26 8.26,46.99 8.26,41.91 6.99,40.64 JP2.1
VBUS
  Top 0.152: U1.51 28.29,99.41 27.94,99.06 12.7,99.06 10.16,101.6 2.9,101.6 1.63,100.33 1.63,62.05 3.31,60.38 4.32,60.38 5.71,61.77 13.01,61.77 13.14,61.63 13.14,60.45 11.43,58.74 11.43,52.6 J7.1
VIN
  Top 0.152: J6.P$1 5.79,61.04 J5.1 | JP1.3 72.39,22.86 73.66,24.13 73.66,26.24 73.97,26.54 73.97,100.46 66.17,108.25 43.05,108.25 42.75,107.95 32.29,107.95
  Top 0.254: J6.P$1 3.17,59.05 1.27,60.96 1.27,102.87 2.18,103.78 4.76,103.78 10.46,109.48 10.46,110.79 11.43,111.76 J8.1 31.11,111.76 32.29,110.58 32.29,107.95 U1.49
WIFI_BOOT
  Top 0.152: U1.12 52.62,32.3 TP3.P$1
WIFI_EN
  Top 0.152: U1.11 49.67,30.48 TP4.P$1
WIFI_RXD
  Top 0.152: U1.14 49.59,36.2 TP1.P$1
WIFI_TXD
  Top 0.152: U1.13 TP2.P$1

### Text on the board
tPlace: + | - | LIPO | 3.9-17 VDC | CR1220 | WITH CR1220 | CAN TERM | MODE | CHRG | WITHOUT BAT | RESET | GNSS | USER | RGB | NFC / ANTENNA | MCU USB | SWD/JTAG / DEBUG | A7 | TX | A6 | CELL USB | RX | A5 | CAN_5V | A4 | CAN_P | CAN_N | 3V3 | A3 | VIN | A2 | LI+ | A1 | A0 | GND | TrackerBase2 / v2 | GNSS USB
bPlace: PMID | TS | GND | A3 | SDA | SCL | 5V | CAN- | CAN+ | VIN | RTC_BAT | WIFI_RXD | CELL_GPS_RX | WIFI_TXD | CELL_GPS_TX | WIFI_BOOT | CELL_RI | WIFI_EN | CELL_GPS_RF | 3V3 | GNSS_PULSE | VIN | GNSS_BOOT | LI+ | GNSS_ANT_PWR | GND | GNSS_LNA_EN | GNSS_LNA_RF | GNSS_RESET | GND | GNSS_BAT